# EAGLE design LCR (EAGLE 9.4.2)

## Sheet 1 of 3
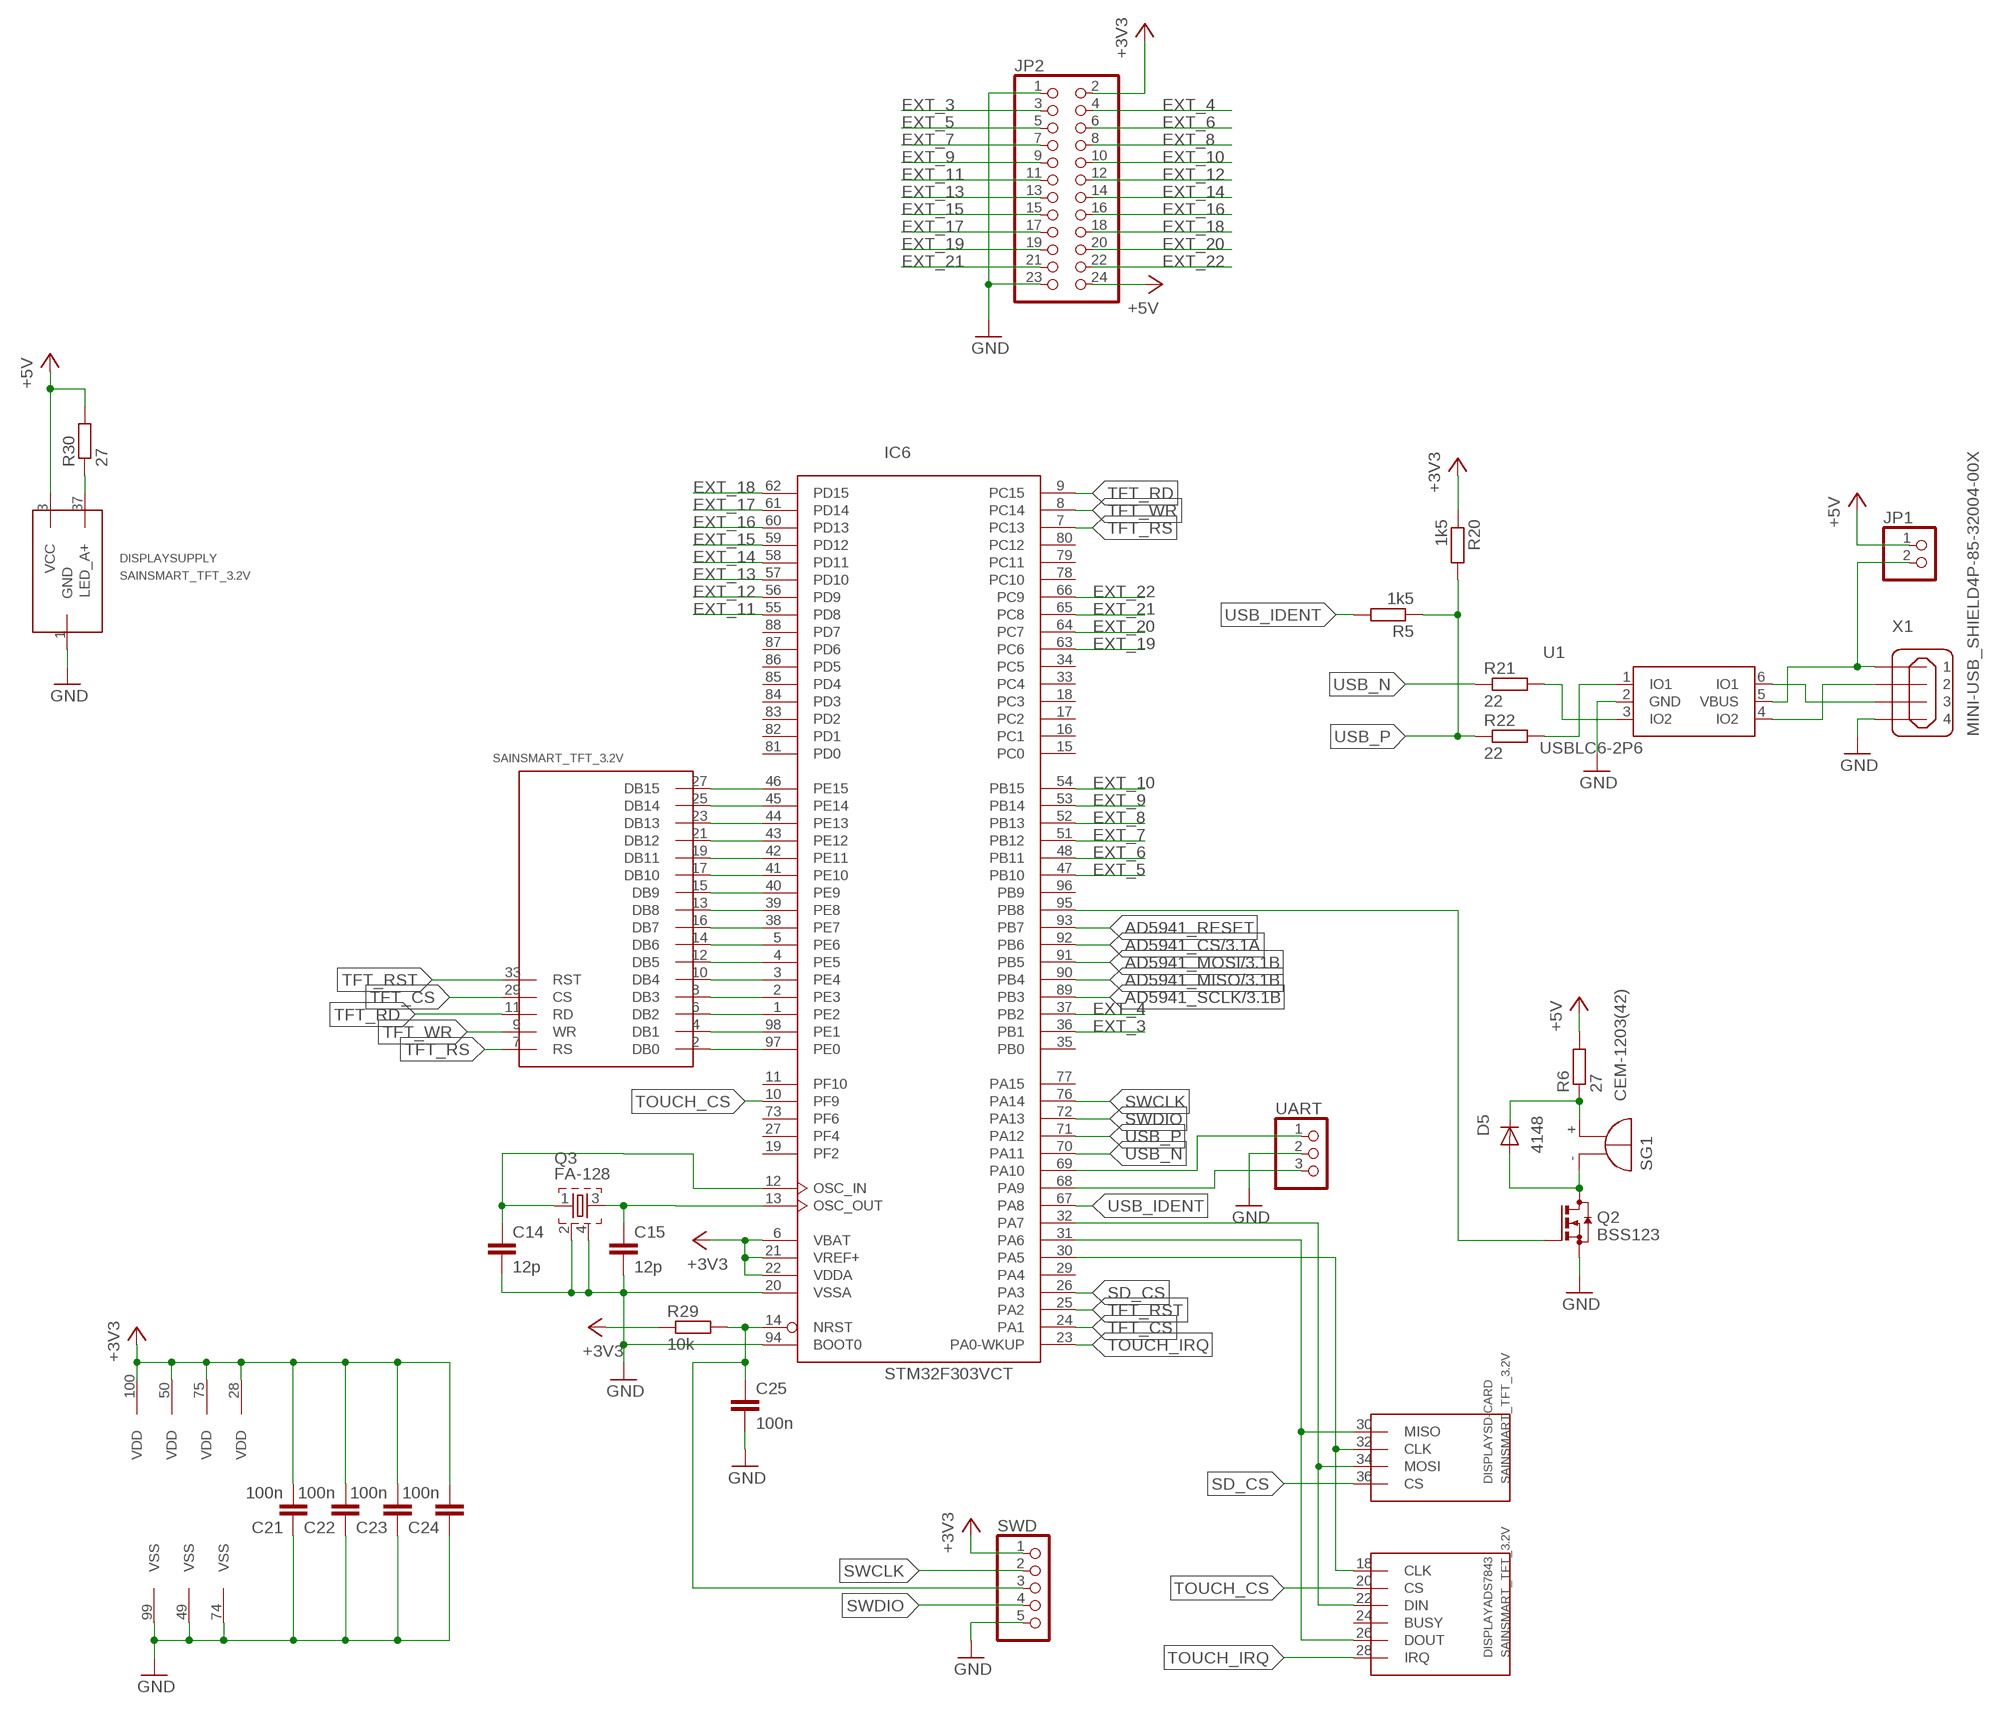
[diagram p0: schematic, sheet 1]

### Parts
C14  12p  C-EUC0603K  [C0603K]
C15  12p  C-EUC0603K  [C0603K]
C21  100n  C-EUC0603K  [C0603K]
C22  100n  C-EUC0603K  [C0603K]
C23  100n  C-EUC0603K  [C0603K]
C24  100n  C-EUC0603K  [C0603K]
C25  100n  C-EUC0603K  [C0603K]
D5  4148  DIODE-SOD123  [SOD123]
DISPLAY  SAINSMART_TFT_3.2V  [SAINSMART_ANGLED]
IC6  STM32F303VCT  [LQFP100]
JP1  PINHD-1X2  [1X02]
JP2  PINHD-2X12  [2X12]
Q2  BSS123  [SOT23]
Q3  FA-128  [FA-128]
R5  1k5  R-EU_R0603  [R0603]
R6  27  R-EU_R1206  [R1206]
R20  1k5  R-EU_R0603  [R0603]
R21  22  R-EU_R0603  [R0603]
R22  22  R-EU_R0603  [R0603]
R29  10k  R-EU_R0603  [R0603]
R30  27  R-EU_R1206  [R1206]
SG1  CEM-1203(42)  F/QMBIII  [F/QMBIII]
SWD  PINHD-1X5  [1X05]
U1  USBLC6-2P6  [SOT23-6]
UART  PINHD-1X3  [1X03]
X1  MINI-USB_SHIELD4P-85-32004-00X  [85-32004-00X]

### Nets
+3V3: C21.2 C22.2 C23.2 C24.2 IC6.6(VBAT) IC6.21(VREF+) IC6.22(VDDA) IC6.28(VDD) IC6.50(VDD) IC6.75(VDD) IC6.100(VDD) JP2.2 R20.1 R29.1 SWD.1 ; also sheet 2,3
+5V: DISPLAY.3(SUPPLY:VCC) JP1.1 JP2.24 R6.2 R30.2 ; also sheet 2
AD5941_CS: IC6.92(PB6) ; also sheet 3
AD5941_MISO: IC6.90(PB4) ; also sheet 3
AD5941_MOSI: IC6.91(PB5) ; also sheet 3
AD5941_RESET: IC6.93(PB7)
AD5941_SCLK: IC6.89(PB3) ; also sheet 3
EXT_3: IC6.36(PB1) JP2.3
EXT_4: IC6.37(PB2) JP2.4
EXT_5: IC6.47(PB10) JP2.5
EXT_6: IC6.48(PB11) JP2.6
EXT_7: IC6.51(PB12) JP2.7
EXT_8: IC6.52(PB13) JP2.8
EXT_9: IC6.53(PB14) JP2.9
EXT_10: IC6.54(PB15) JP2.10
EXT_11: IC6.55(PD8) JP2.11
EXT_12: IC6.56(PD9) JP2.12
EXT_13: IC6.57(PD10) JP2.13
EXT_14: IC6.58(PD11) JP2.14
EXT_15: IC6.59(PD12) JP2.15
EXT_16: IC6.60(PD13) JP2.16
EXT_17: IC6.61(PD14) JP2.17
EXT_18: IC6.62(PD15) JP2.18
EXT_19: IC6.63(PC6) JP2.19
EXT_20: IC6.64(PC7) JP2.20
EXT_21: IC6.65(PC8) JP2.21
EXT_22: IC6.66(PC9) JP2.22
GND: C14.2 C15.2 C21.1 C22.1 C23.1 C24.1 C25.2 DISPLAY.1(SUPPLY:GND) IC6.20(VSSA) IC6.49(VSS) IC6.74(VSS) IC6.94(BOOT0) IC6.99(VSS) JP2.1 JP2.23 Q2.2(S) Q3.2 Q3.4 SWD.5 U1.2(GND) UART.2 X1.4 ; also sheet 2,3
N$22: R21.2 U1.3(IO2)
N$38: IC6.95(PB8) Q2.1(G)
N$40: R22.2 U1.1(IO1)
N$41: DISPLAY.2(SSD1289:DB0) IC6.97(PE0)
N$43: DISPLAY.4(SSD1289:DB1) IC6.98(PE1)
N$44: DISPLAY.6(SSD1289:DB2) IC6.1(PE2)
N$45: DISPLAY.8(SSD1289:DB3) IC6.2(PE3)
N$46: DISPLAY.22(ADS7843:DIN) DISPLAY.34(SD-CARD:MOSI) IC6.32(PA7)
N$47: DISPLAY.10(SSD1289:DB4) IC6.3(PE4)
N$48: DISPLAY.12(SSD1289:DB5) IC6.4(PE5)
N$49: DISPLAY.14(SSD1289:DB6) IC6.5(PE6)
N$50: DISPLAY.16(SSD1289:DB7) IC6.38(PE7)
N$51: DISPLAY.26(ADS7843:DOUT) DISPLAY.30(SD-CARD:MISO) IC6.31(PA6)
N$52: DISPLAY.18(ADS7843:CLK) DISPLAY.32(SD-CARD:CLK) IC6.30(PA5)
N$53: C14.1 IC6.12(OSC_IN) Q3.1
N$54: C15.1 IC6.13(OSC_OUT) Q3.3
N$55: U1.6(IO1) X1.3
N$56: U1.4(IO2) X1.2
N$61: DISPLAY.37(SUPPLY:LED_A+) R30.1
N$62: DISPLAY.13(SSD1289:DB8) IC6.39(PE8)
N$63: DISPLAY.15(SSD1289:DB9) IC6.40(PE9)
N$64: DISPLAY.17(SSD1289:DB10) IC6.41(PE10)
N$65: DISPLAY.19(SSD1289:DB11) IC6.42(PE11)
N$66: JP1.2 U1.5(VBUS) X1.1
N$67: D5.C R6.1 SG1.+(-)
N$68: DISPLAY.21(SSD1289:DB12) IC6.43(PE12)
N$69: DISPLAY.23(SSD1289:DB13) IC6.44(PE13)
N$70: DISPLAY.25(SSD1289:DB14) IC6.45(PE14)
N$71: DISPLAY.27(SSD1289:DB15) IC6.46(PE15)
N$72: D5.A Q2.3(D) SG1.-(+)
NRST: C25.1 IC6.14(NRST) R29.2 SWD.3
RX: IC6.69(PA10) UART.1
SD_CS: DISPLAY.36(SD-CARD:CS) IC6.26(PA3)
SWCLK: IC6.76(PA14) SWD.2
SWDIO: IC6.72(PA13) SWD.4
TFT_CS: DISPLAY.29(SSD1289:CS) IC6.24(PA1)
TFT_RD: DISPLAY.11(SSD1289:RD) IC6.9(PC15)
TFT_RS: DISPLAY.7(SSD1289:RS) IC6.7(PC13)
TFT_RST: DISPLAY.33(SSD1289:RST) IC6.25(PA2)
TFT_WR: DISPLAY.9(SSD1289:WR) IC6.8(PC14)
TOUCH_CS: DISPLAY.20(ADS7843:CS) IC6.10(PF9)
TOUCH_IRQ: DISPLAY.28(ADS7843:IRQ) IC6.23(PA0-WKUP)
TX: IC6.68(PA9) UART.3
USB_IDENT: IC6.67(PA8) R5.2
USB_N: IC6.70(PA11) R21.1
USB_P: IC6.71(PA12) R5.1 R20.2 R22.1
Unconnected: DISPLAY.24(ADS7843:BUSY) IC6.11(PF10) IC6.15(PC0) IC6.16(PC1) IC6.17(PC2) IC6.18(PC3) IC6.19(PF2) IC6.27(PF4) IC6.29(PA4) IC6.33(PC4) IC6.34(PC5) IC6.35(PB0) IC6.73(PF6) IC6.77(PA15) IC6.78(PC10) IC6.79(PC11) IC6.80(PC12) IC6.81(PD0) IC6.82(PD1) IC6.83(PD2) IC6.84(PD3) IC6.85(PD4) IC6.86(PD5) IC6.87(PD6) IC6.88(PD7) IC6.96(PB9) X1.M1(S1) X1.M2(S2)

## Sheet 2 of 3
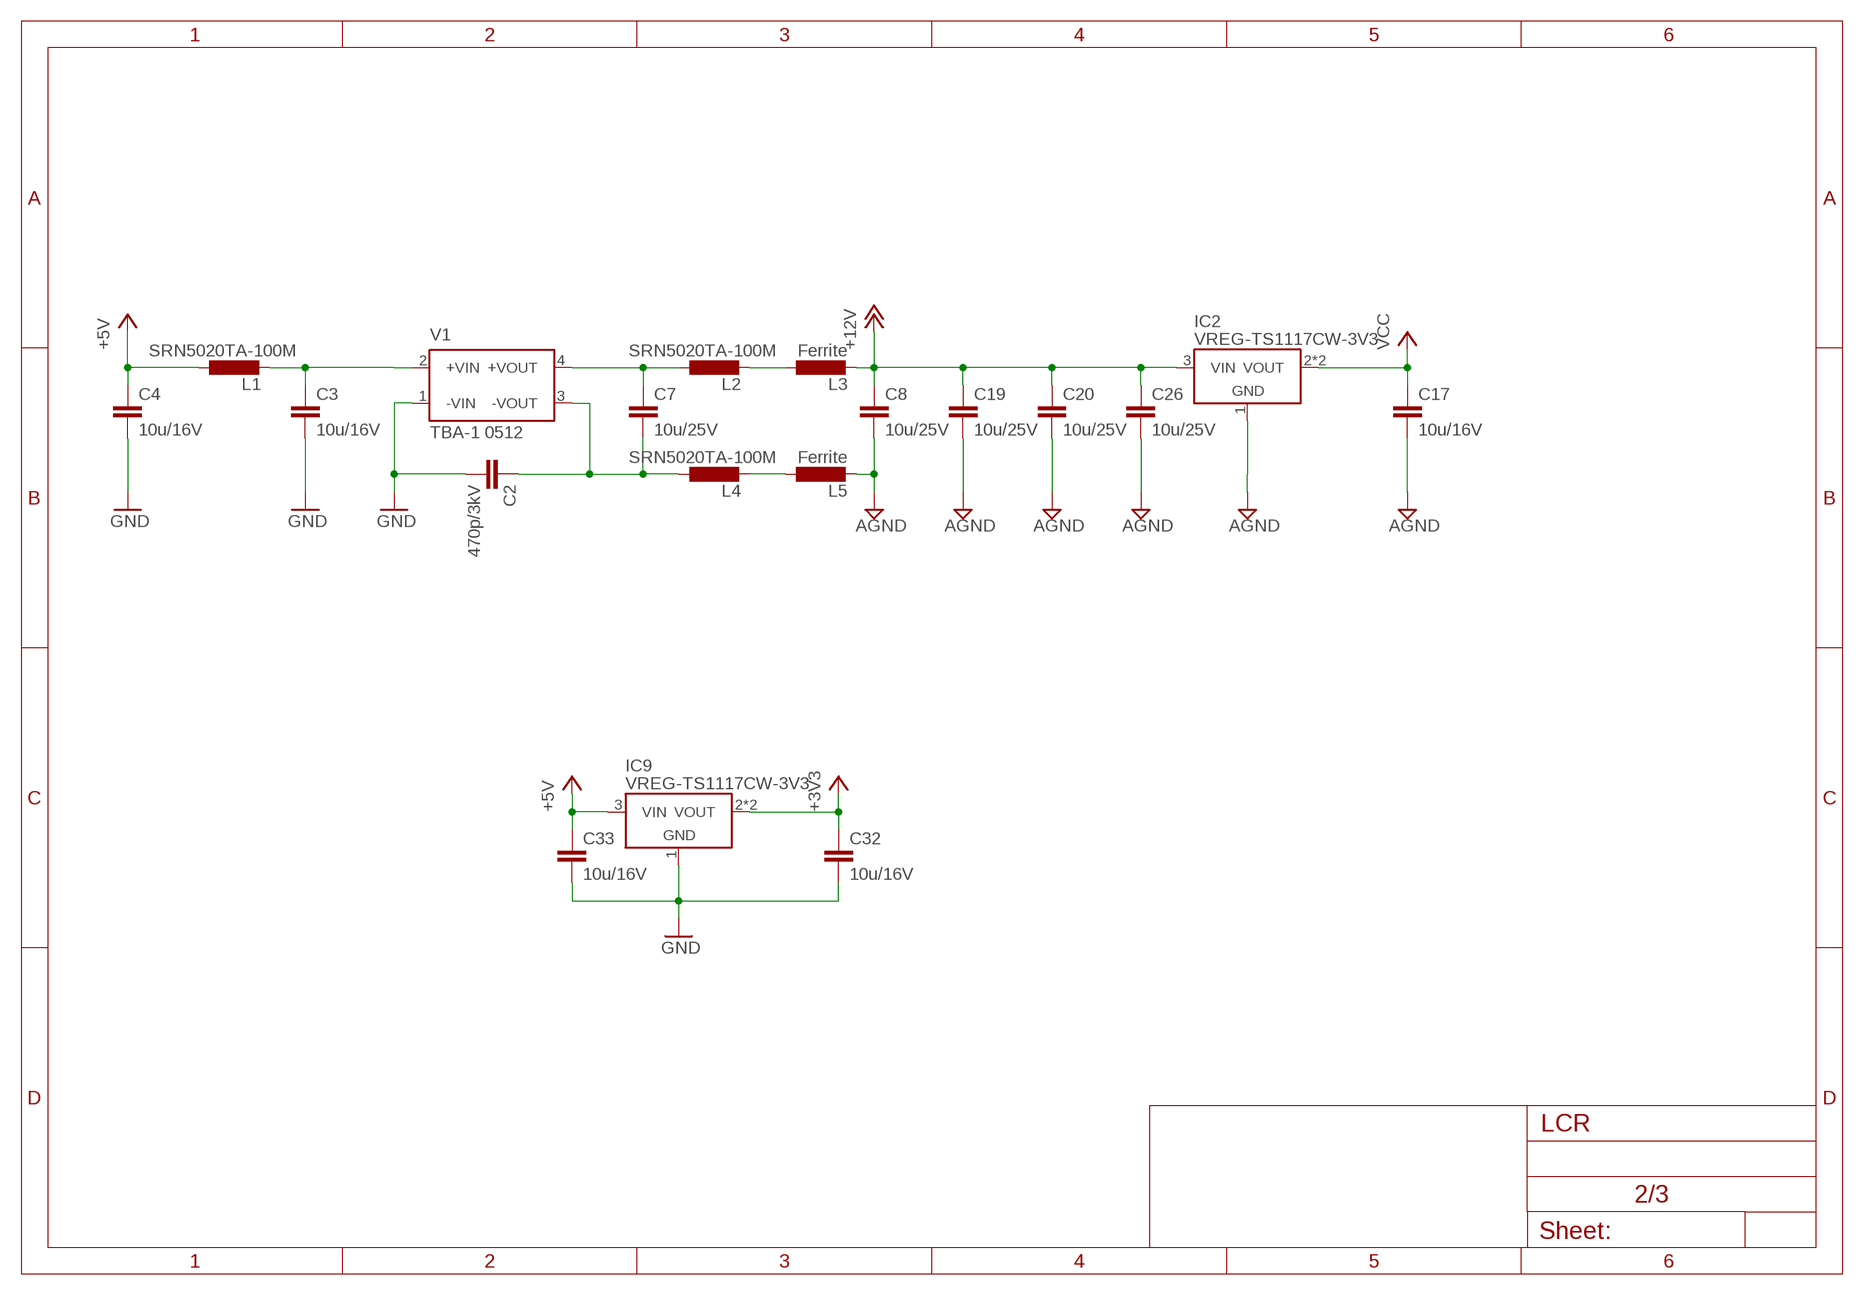
[diagram p1: schematic, sheet 2]

### Parts
C2  470p/3kV  C-EUC1812  [C1812]
C3  10u/16V  C-EUC1206K  [C1206K]
C4  10u/16V  C-EUC1206K  [C1206K]
C7  10u/25V  C-EUC1206K  [C1206K]
C8  10u/25V  C-EUC1206K  [C1206K]
C17  10u/16V  C-EUC1206K  [C1206K]
C19  10u/25V  C-EUC1206K  [C1206K]
C20  10u/25V  C-EUC1206K  [C1206K]
C26  10u/25V  C-EUC1206K  [C1206K]
C32  10u/16V  C-EUC1206K  [C1206K]
C33  10u/16V  C-EUC1206K  [C1206K]
IC2  VREG-TS1117CW-3V3  [SOT223]
IC9  VREG-TS1117CW-3V3  [SOT223]
L1  SRN5020TA-100M  SRN5040  [SRN5040]
L2  SRN5020TA-100M  SRN5040  [SRN5040]
L3  Ferrite  INDUCTOR0603  [R0603]
L4  SRN5020TA-100M  SRN5040  [SRN5040]
L5  Ferrite  INDUCTOR0603  [R0603]
V1  TBA-1 0512  TME0505S  [TME]

### Nets
+3V3: C32.1 IC9.2(VOUT) IC9.4(VOUT) ; also sheet 1,3
+5V: C4.1 C33.1 IC9.3(VIN) L1.P$1 ; also sheet 1
+12V: C8.1 C19.1 C20.1 C26.1 IC2.3(VIN) L3.2 ; also sheet 3
AGND: C8.2 C17.2 C19.2 C20.2 C26.2 IC2.1(GND) L5.2 ; also sheet 3
GND: C2.2 C3.2 C4.2 C32.2 C33.2 IC9.1(GND) V1.1(-VIN) ; also sheet 1,3
N$20: C3.1 L1.P$2 V1.2(+VIN)
N$25: C7.1 L2.P$1 V1.4(+VOUT)
N$26: C2.1 C7.2 L4.P$1 V1.3(-VOUT)
N$36: L2.P$2 L3.1
N$58: L4.P$2 L5.1
VCC: C17.1 IC2.2(VOUT) IC2.4(VOUT) ; also sheet 3

## Sheet 3 of 3
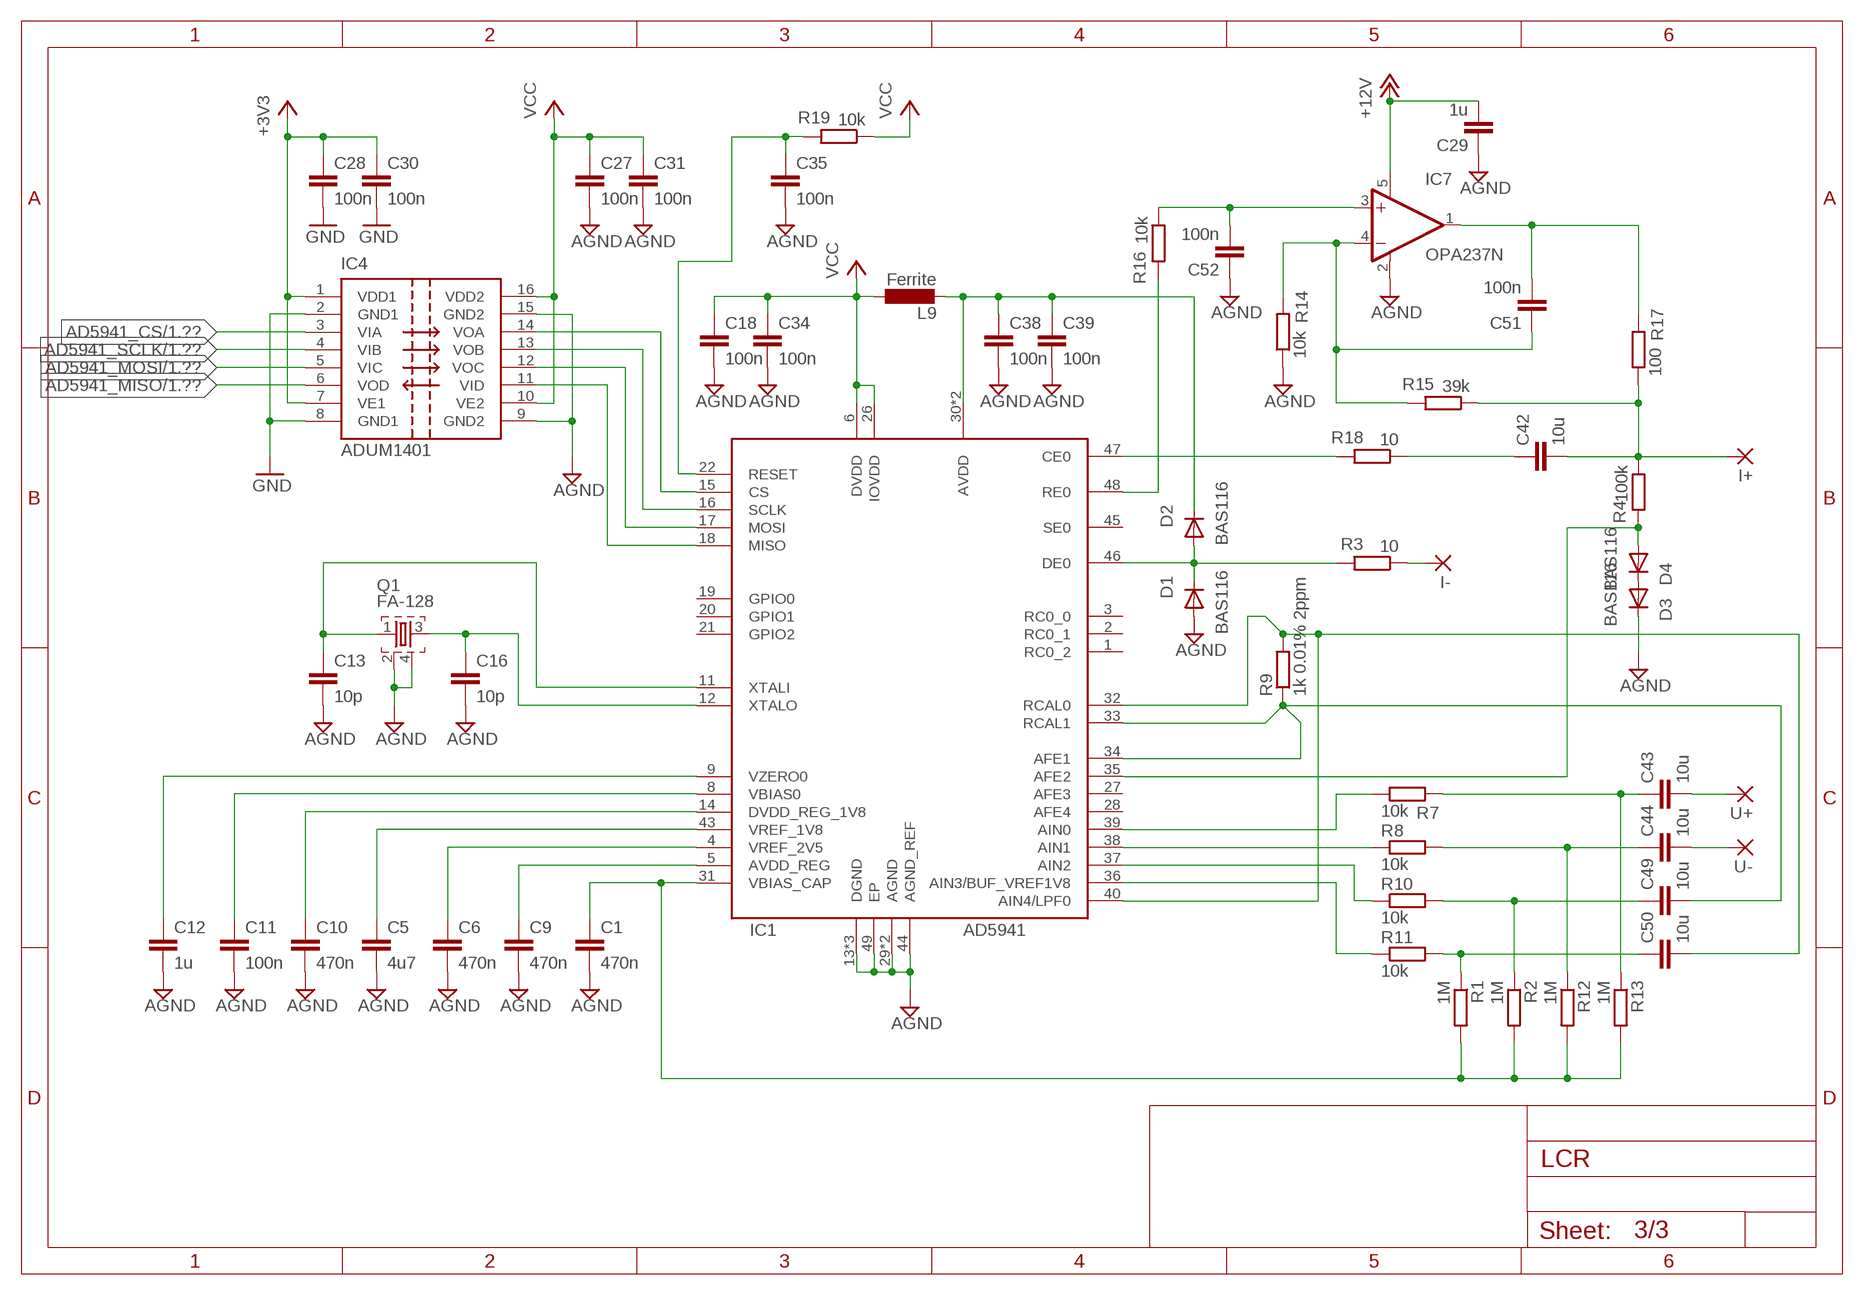
[diagram p2: schematic, sheet 3]

### Parts
C1  470n  C-EUC0603K  [C0603K]
C5  4u7  C-EUC0603K  [C0603K]
C6  470n  C-EUC0603K  [C0603K]
C9  470n  C-EUC0603K  [C0603K]
C10  470n  C-EUC0603K  [C0603K]
C11  100n  C-EUC0603K  [C0603K]
C12  1u  C-EUC0603K  [C0603K]
C13  10p  C-EUC0603K  [C0603K]
C16  10p  C-EUC0603K  [C0603K]
C18  100n  C-EUC0603K  [C0603K]
C27  100n  C-EUC0603K  [C0603K]
C28  100n  C-EUC0603K  [C0603K]
C29  1u  C-EUC0603K  [C0603K]
C30  100n  C-EUC0603K  [C0603K]
C31  100n  C-EUC0603K  [C0603K]
C34  100n  C-EUC0603K  [C0603K]
C35  100n  C-EUC0603K  [C0603K]
C38  100n  C-EUC0603K  [C0603K]
C39  100n  C-EUC0603K  [C0603K]
C42  10u  C-EUC1206K  [C1206K]
C43  10u  C-EUC1206K  [C1206K]
C44  10u  C-EUC1206K  [C1206K]
C49  10u  C-EUC1206K  [C1206K]
C50  10u  C-EUC1206K  [C1206K]
C51  100n  C-EUC0603K  [C0603K]
C52  100n  C-EUC0603K  [C0603K]
D1  BAS116  DIODE-SOD123  [SOD123]
D2  BAS116  DIODE-SOD123  [SOD123]
D3  BAS116  DIODE-SOD123  [SOD123]
D4  BAS116  DIODE-SOD123  [SOD123]
I+  2,54/1,1  [2,54/1,1]
I-  2,54/1,1  [2,54/1,1]
IC1  AD5941  [QFN50P700X700X80-49T510N]
IC4  ADUM1401  [SO16W]
IC7  OPA237N  [SOT23-5]
L9  Ferrite  INDUCTOR0603  [R0603]
Q1  FA-128  [FA-128]
R1  1M  R-EU_R0603  [R0603]
R2  1M  R-EU_R0603  [R0603]
R3  10  R-EU_R0603  [R0603]
R4  100k  R-EU_R0603  [R0603]
R7  10k  R-EU_R0603  [R0603]
R8  10k  R-EU_R0603  [R0603]
R9  1k 0.01% 2ppm  R-EU_M0805  [M0805]
R10  10k  R-EU_R0603  [R0603]
R11  10k  R-EU_R0603  [R0603]
R12  1M  R-EU_R0603  [R0603]
R13  1M  R-EU_R0603  [R0603]
R14  10k  R-EU_R0603  [R0603]
R15  39k  R-EU_R0603  [R0603]
R16  10k  R-EU_R0603  [R0603]
R17  100  R-EU_R0603  [R0603]
R18  10  R-EU_R0603  [R0603]
R19  10k  R-EU_R0603  [R0603]
U+  2,54/1,1  [2,54/1,1]
U-  2,54/1,1  [2,54/1,1]

### Nets
+3V3: C28.1 C30.1 IC4.1(VDD1) IC4.7(VE1) ; also sheet 1,2
+12V: C29.2 IC7.5(V+) ; also sheet 2
AD5941_CS: IC4.3(VIA) ; also sheet 1
AD5941_MISO: IC4.6(VOD) ; also sheet 1
AD5941_MOSI: IC4.5(VIC) ; also sheet 1
AD5941_SCLK: IC4.4(VIB) ; also sheet 1
AGND: C1.2 C5.2 C6.2 C9.2 C10.2 C11.2 C12.2 C13.2 C16.2 C18.2 C27.2 C29.1 C31.2 C34.2 C35.2 C38.2 C39.2 C52.1 D1.A D3.C IC1.13(DGND) IC1.23(DGND) IC1.25(DGND) IC1.29(AGND) IC1.42(AGND) IC1.44(AGND_REF) IC1.49(EP) IC4.9(GND2) IC4.15(GND2) IC7.2(V-) Q1.2 Q1.4 R14.1 ; also sheet 2
GND: C28.2 C30.2 IC4.2(GND1) IC4.8(GND1) ; also sheet 1,2
I+: C42.2 I+.1(P) R4.1 R15.1 R17.1
I-: I-.1(P) R3.1
N$1: C1.1 IC1.31(VBIAS_CAP) R1.2 R2.2 R12.2 R13.2
N$2: C6.1 IC1.4(VREF_2V5)
N$3: C5.1 IC1.43(VREF_1V8)
N$4: C9.1 IC1.5(AVDD_REG)
N$5: C10.1 IC1.14(DVDD_REG_1V8)
N$6: C11.1 IC1.8(VBIAS0)
N$7: C12.1 IC1.9(VZERO0)
N$8: C16.1 IC1.12(XTALO) Q1.3
N$9: C13.1 IC1.11(XTALI) Q1.1
N$10: IC1.17(MOSI) IC4.12(VOC)
N$11: C42.1 R18.1
N$12: C35.1 IC1.22(RESET) R19.2
N$13: IC1.15(CS) IC4.14(VOA)
N$14: IC1.16(SCLK) IC4.13(VOB)
N$15: IC1.18(MISO) IC4.11(VID)
N$16: C38.1 C39.1 D2.C IC1.30(AVDD) IC1.41(AVDD) L9.2
N$17: IC1.47(CE0) R18.2
N$18: IC1.39(AIN0) R7.1
N$19: IC1.38(AIN1) R8.1
N$21: C44.1 R8.2 R12.1
N$23: C43.1 R7.2 R13.1
N$24: C49.2 IC1.33(RCAL1) IC1.34(AFE1) R9.1
N$27: IC1.37(AIN2) R10.1
N$28: IC1.36(AIN3/BUF_VREF1V8) R11.1
N$29: C50.1 R1.1 R11.2
N$30: C49.1 R2.1 R10.2
N$31: IC1.48(RE0) R16.2
N$32: C52.2 IC7.3(+IN) R16.1
N$33: C51.1 IC7.4(-IN) R14.2 R15.2
N$34: C51.2 IC7.1(OUT) R17.2
N$35: D1.C D2.A IC1.46(DE0) R3.2
N$37: D4.A IC1.35(AFE2) R4.2
N$39: D3.A D4.C
N$59: C50.2 IC1.32(RCAL0) IC1.40(AIN4/LPF0) R9.2
U+: C43.2 U+.1(P)
U-: C44.2 U-.1(P)
VCC: C18.1 C27.1 C31.1 C34.1 IC1.6(DVDD) IC1.26(IOVDD) IC4.10(VE2) IC4.16(VDD2) L9.1 R19.1 ; also sheet 2
Unconnected: IC1.1(RC0_2) IC1.2(RC0_1) IC1.3(RC0_0) IC1.19(GPIO0) IC1.20(GPIO1) IC1.21(GPIO2) IC1.27(AFE3) IC1.28(AFE4) IC1.45(SE0)

## Library data of the parts
C1 C3-C35 C38 C39 C51 C52 = rcl:C-EU: CAPACITOR, European symbol
C2 C42-C44 C49 C50 = resistor:C-EU: CAPACITOR, European symbol
D1-D5 = diode:DIODE-: DIODE
DISPLAY = sainsmart:SAINSMART_TFT_3.2
I+ I- U+ U- = wirepad:2,54/1,1: THROUGH-HOLE PAD
IC1 = custom-ic:AD5941
IC2 IC9 = we-power-mod:VREG: Voltage Regulators (LDOs, Switching Converters...) LDOs Taiwan Semi TS1117 800mA max 15V - compatible On Semi NCP1117 1A max 20V - compatible Diodes AP2111H 0.6A max 6V (0.25V@0.6A) - compatible Diodes AP2114H 1A max 6V (0.45V@1A) Taiwan Semi TS9011 250mA max 12V - compatible Diodes AP2210 300mA max 15V - compatible Microchip MCP1700 250mA max 6.5V - compatible Microchip MCP1702 250mA max 13V - compatible Microchip MCP1703 250mA max 16V - compatible Microchip MCP1754 150mA max 16V Taiwan Semi TS5204 150mA max 16V (low noise) DC/DC Converter Modules Recom R-78Ex.x-1.0-W36 1A max 28V - compatible CUI V78xx-2000 2A max 18V Murata OKI-78SR-x.x/1.5-W36 1.5A max 36V
IC4 = adum140x:ADUM1401
IC6 = micro-stm_v3:STM32F303V*T: ARM 32-bit Cortex™-M3 CPU 72 MHz maximum frequency 128 to 256 Kbytes of Flash memory 32 to 40 kbytes of SRAM 87 GPIOs 2.0 to 3.6 V application supply
IC7 = burr-brown:OPA237: Operational Amplifiers Single-Supply, MicroAmplifier(TM) Series; MF: TEXAS INSTRUMENTS; MPN: OPA237NA/250; OC_FARNELL: 4625298; OC_NEWARK: 35C1874
JP1 = pinhead:PINHD-1X2: PIN HEADER
JP2 = pinhead:PINHD-2X12: PIN HEADER
L1 L2 L4 = custom-ic:SRN5040
L3 L5 L9 = rf:INDUCTOR
Q1 Q3 = crystal:FA-: MHz RANGE CRYSTAL UNIT Source: Epson Toyocom
Q2 = transistor-small-signal:BSS123: N-CHANNEL MOS FET
R1-R4 R7 R8 R10-R19 = rcl:R-EU_: RESISTOR, European symbol
R5 R6 R9 R20-R22 R29 R30 = resistor:R-EU_: RESISTOR, European symbol
SG1 = buzzer:F/QMBIII: BUZZER Source: Buerklin; OC_FARNELL: unknown; OC_NEWARK: unknown
SWD = pinhead:PINHD-1X5: PIN HEADER
U1 = alemv:USBLC6-2P6: Very low capacitance ESD protection of VBUS (USB)
UART = pinhead:PINHD-1X3: PIN HEADER
V1 = traco-electronic:TME?*: DC/DC Converter TME Series 1 Watt Source: www.tracopower.com .. tme.pdf; MPN: TME 0505S; OC_FARNELL: 1007538; OC_NEWARK: 51R5321
X1 = con-cypressindustries:MINI-USB_SHIELD4P-: MINI USB 4 Pol. Source: www.cypressindustries.com; OC_FARNELL: unknown; OC_NEWARK: unknown

## Net classes
0 default: width 0.3 mm

## Board
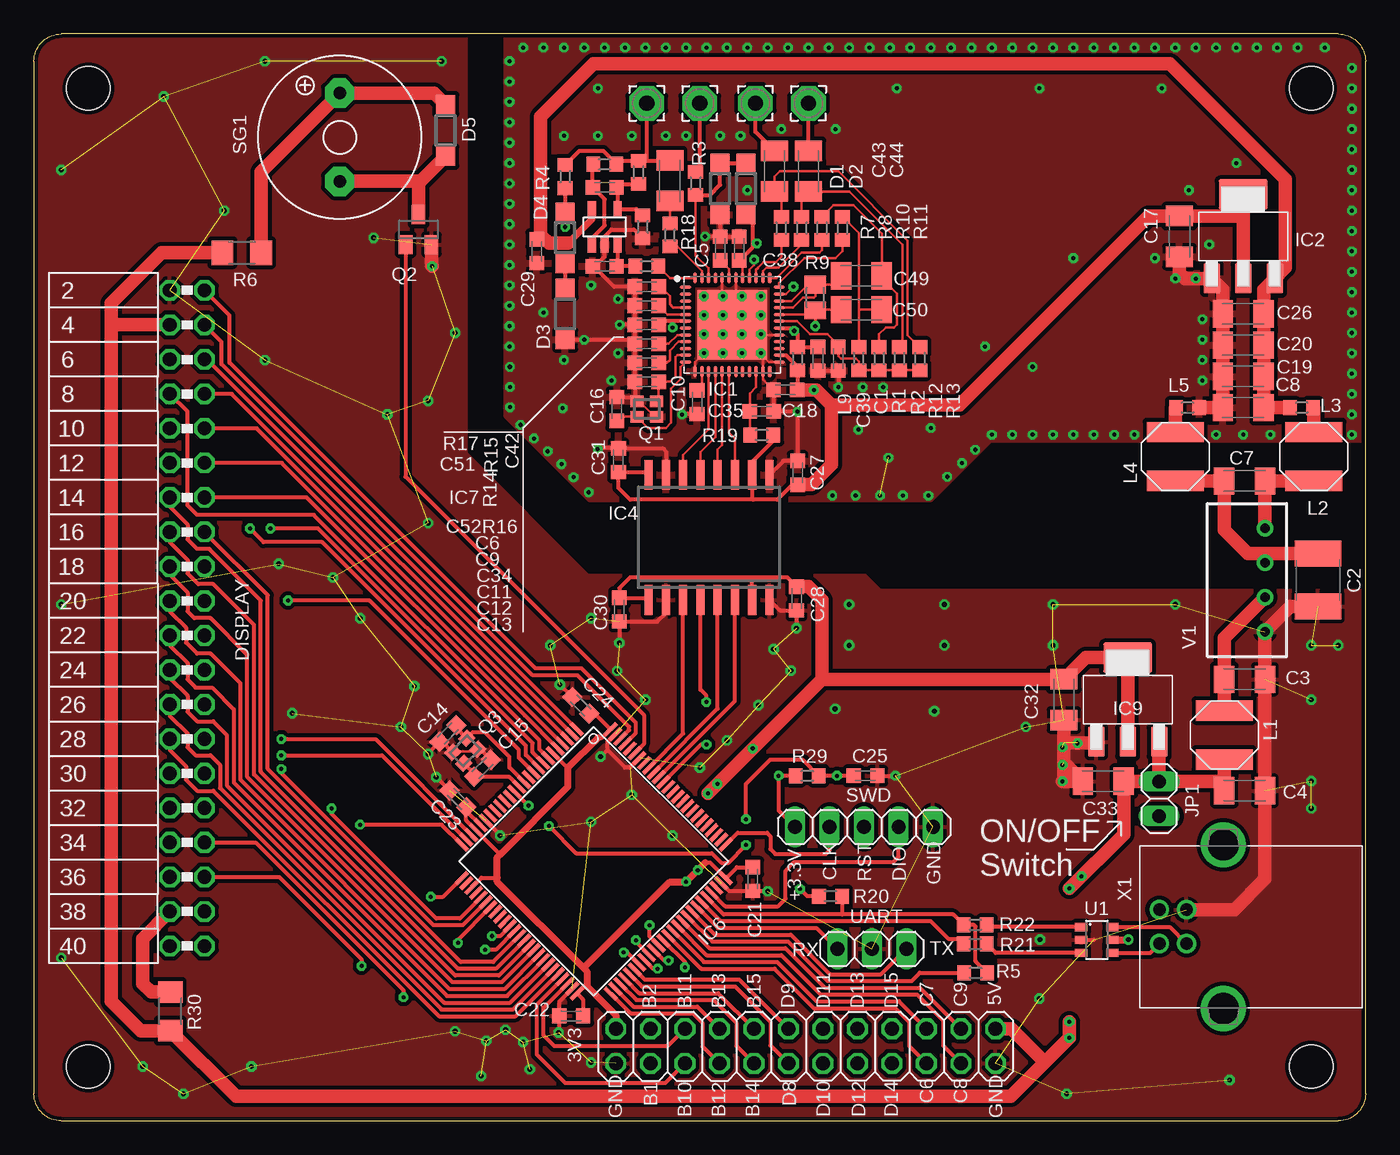
[diagram p3: board, top side]
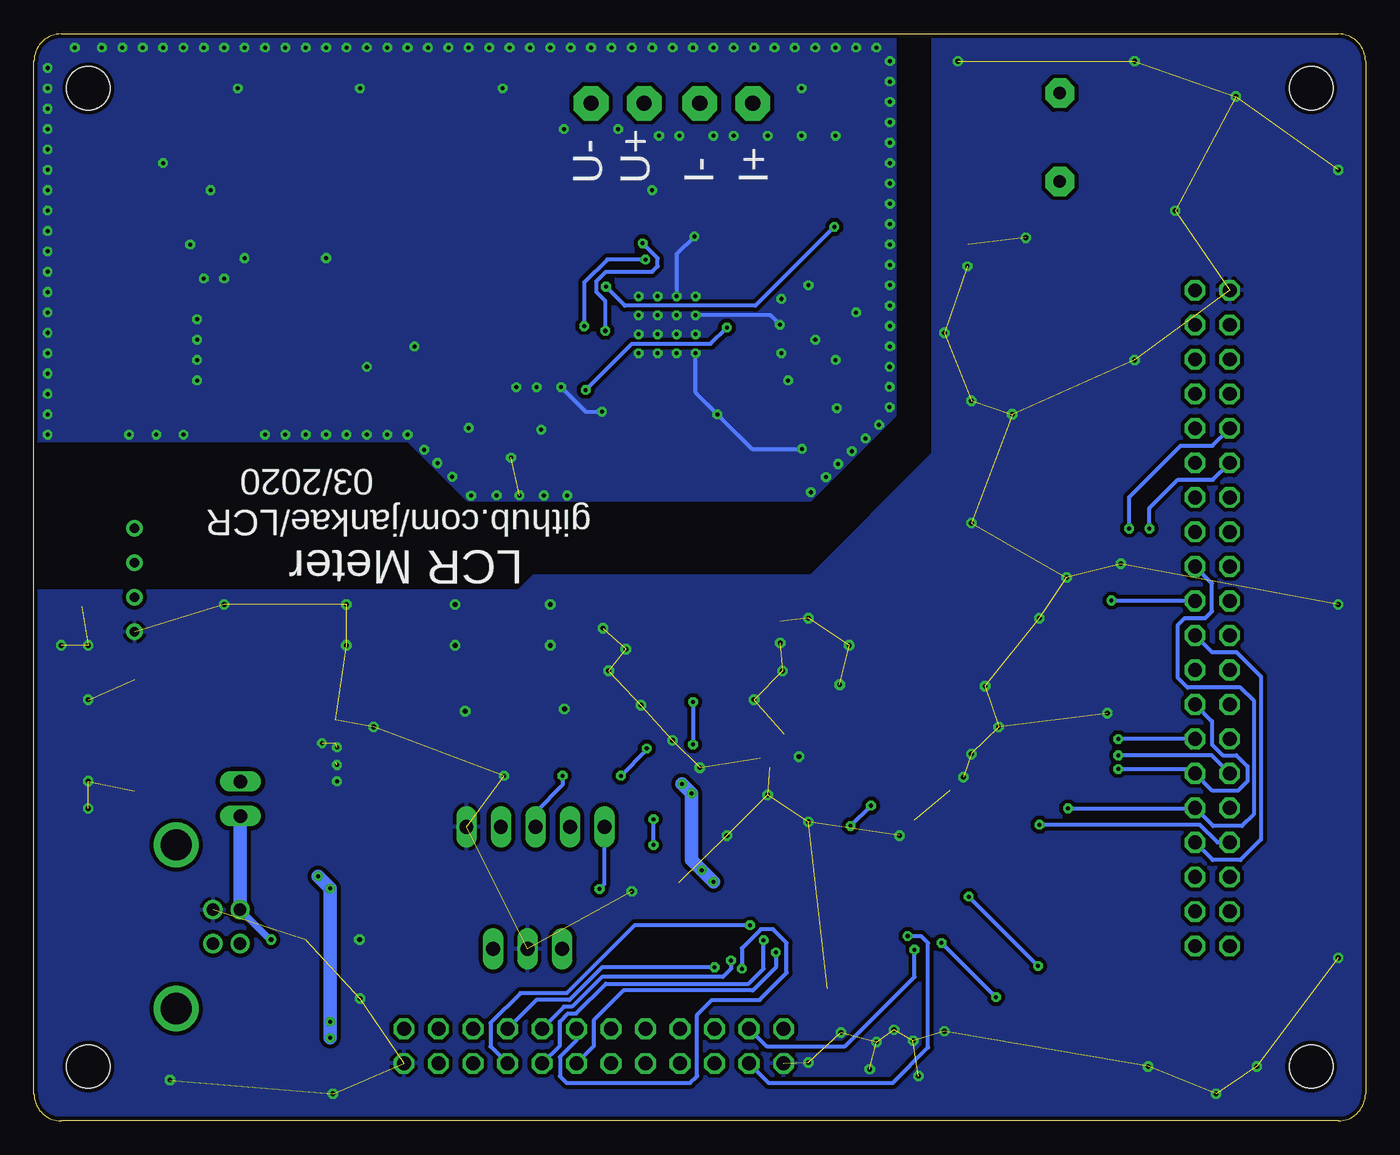
[diagram p4: board, bottom side, seen from below]

Size 98 x 80 mm. Coordinates in mm from the lower left corner, seen from the top.
Outline: 2,0 96,0 arc90 98,2 98,78 arc90 96,80 2,80 arc90 0,78 0,2 arc90 2,0
Copper layers (1*16): Top 0.035mm / dielectric 1.55mm / Bottom 0.035mm
Design rules "JLCPCB4L_7628 *": minimum track width 6mil, minimum drill 0.3mm, track to track 3.5mil, track to pad 3.5mil, pad to pad 3.5mil, via to via 3.5mil, smd to smd 0mil, copper to edge 0.2mm, drill to drill 0.2mm, minimum pad ring 10mil, minimum via ring 8mil, stop-mask expansion 4mil, vias tented up to drill 0mil, thermal gap 10mil
Holes 3.2 mm at 94,4 94,76 4,4 4,76
tKeepout: area 91,73 to 97,79; area 91,1 to 97,7; area 1,1 to 7,7; area 1,73 to 7,79

### Footprints (pad centres in the part's own frame; a part is rotated, then mirrored left to right if it is on the bottom)
C0603K = smd 1.05 x 1.08: 1 -0.875,0; 2 0.875,0
C1812 = smd 1.9 x 3.4: 1 -1.95,0; 2 1.95,0
C1206K = smd 1.5 x 2: 1 -1.5,0; 2 1.5,0
SOD123 = smd 1.4 x 1.4: A 1.9,0; C -1.9,0
SAINSMART_ANGLED = drill 1.016 octagon: 1 -24.13,0; 2 -24.13,2.54; 3 -21.59,0; 4 -21.59,2.54; 5 -19.05,0; 6 -19.05,2.54; 7 -16.51,0; 8 -16.51,2.54; 9 -13.97,0; 10 -13.97,2.54; 11 -11.43,0; 12 -11.43,2.54; 13 -8.89,0; 14 -8.89,2.54; 15 -6.35,0; 16 -6.35,2.54; 17 -3.81,0; 18 -3.81,2.54; 19 -1.27,0; 20 -1.27,2.54; 21 1.27,0; 22 1.27,2.54; 23 3.81,0; 24 3.81,2.54; 25 6.35,0; 26 6.35,2.54; 27 8.89,0; 28 8.89,2.54; 29 11.43,0; 30 11.43,2.54; 31 13.97,0; 32 13.97,2.54; 33 16.51,0; 34 16.51,2.54; 35 19.05,0; 36 19.05,2.54; 37 21.59,0; 38 21.59,2.54; 39 24.13,0; 40 24.13,2.54
2,54/1,1 = drill 1.118 pad 2.54 octagon: 1 0,0
QFN50P700X700X80-49T510N = smd 0.838 x 0.264: 1 -3.446,2.75; 2 -3.446,2.25; 3 -3.446,1.75; 4 -3.446,1.25; 5 -3.446,0.75; 6 -3.446,0.25; 7 -3.446,-0.25; 8 -3.446,-0.75; 9 -3.446,-1.25; 10 -3.446,-1.75; 11 -3.446,-2.25; 12 -3.446,-2.75; 25 3.446,-2.75; 26 3.446,-2.25; 27 3.446,-1.75; 28 3.446,-1.25; 29 3.446,-0.75; 30 3.446,-0.25; 31 3.446,0.25; 32 3.446,0.75; 33 3.446,1.25; 34 3.446,1.75; 35 3.446,2.25; 36 3.446,2.75 | smd 0.264 x 0.838: 13 -2.75,-3.446; 14 -2.25,-3.446; 15 -1.75,-3.446; 16 -1.25,-3.446; 17 -0.75,-3.446; 18 -0.25,-3.446; 19 0.25,-3.446; 20 0.75,-3.446; 21 1.25,-3.446; 22 1.75,-3.446; 23 2.25,-3.446; 24 2.75,-3.446; 37 2.75,3.446; 38 2.25,3.446; 39 1.75,3.446; 40 1.25,3.446; 41 0.75,3.446; 42 0.25,3.446; 43 -0.25,3.446; 44 -0.75,3.446; 45 -1.25,3.446; 46 -1.75,3.446; 47 -2.25,3.446; 48 -2.75,3.446 | smd 5.1 x 5.1: 49 0,0
SOT223 = smd 2.235 x 1.219: 1 -3.099,2.311; 2 -3.099,0; 3 -3.099,-2.311 | smd 2.2 x 3.6: 4 3.099,0
SO16W = smd 0.6 x 2.2: 1 -4.445,-4.6; 2 -3.175,-4.6; 3 -1.905,-4.6; 4 -0.635,-4.6; 5 0.635,-4.6; 6 1.905,-4.6; 7 3.175,-4.6; 8 4.445,-4.6; 9 4.445,4.6; 10 3.175,4.6; 11 1.905,4.6; 12 0.635,4.6; 13 -0.635,4.6; 14 -1.905,4.6; 15 -3.175,4.6; 16 -4.445,4.6
LQFP100 = smd 0.3 x 1.2: 1 -6,-7.75; 2 -5.5,-7.75; 3 -5,-7.75; 4 -4.5,-7.75; 5 -4,-7.75; 6 -3.5,-7.75; 7 -3,-7.75; 8 -2.5,-7.75; 9 -2,-7.75; 10 -1.5,-7.75; 11 -1,-7.75; 12 -0.5,-7.75; 13 0,-7.75; 14 0.5,-7.75; 15 1,-7.75; 16 1.5,-7.75; 17 2,-7.75; 18 2.5,-7.75; 19 3,-7.75; 20 3.5,-7.75; 21 4,-7.75; 22 4.5,-7.75; 23 5,-7.75; 24 5.5,-7.75; 25 6,-7.75; 51 6,7.75; 52 5.5,7.75; 53 5,7.75; 54 4.5,7.75; 55 4,7.75; 56 3.5,7.75; 57 3,7.75; 58 2.5,7.75; 59 2,7.75; 60 1.5,7.75; 61 1,7.75; 62 0.5,7.75; 63 0,7.75; 64 -0.5,7.75; 65 -1,7.75; 66 -1.5,7.75; 67 -2,7.75; 68 -2.5,7.75; 69 -3,7.75; 70 -3.5,7.75; 71 -4,7.75; 72 -4.5,7.75; 73 -5,7.75; 74 -5.5,7.75; 75 -6,7.75 | smd 1.2 x 0.3: 26 7.75,-6; 27 7.75,-5.5; 28 7.75,-5; 29 7.75,-4.5; 30 7.75,-4; 31 7.75,-3.5; 32 7.75,-3; 33 7.75,-2.5; 34 7.75,-2; 35 7.75,-1.5; 36 7.75,-1; 37 7.75,-0.5; 38 7.75,0; 39 7.75,0.5; 40 7.75,1; 41 7.75,1.5; 42 7.75,2; 43 7.75,2.5; 44 7.75,3; 45 7.75,3.5; 46 7.75,4; 47 7.75,4.5; 48 7.75,5; 49 7.75,5.5; 50 7.75,6; 76 -7.75,6; 77 -7.75,5.5; 78 -7.75,5; 79 -7.75,4.5; 80 -7.75,4; 81 -7.75,3.5; 82 -7.75,3; 83 -7.75,2.5; 84 -7.75,2; 85 -7.75,1.5; 86 -7.75,1; 87 -7.75,0.5; 88 -7.75,0; 89 -7.75,-0.5; 90 -7.75,-1; 91 -7.75,-1.5; 92 -7.75,-2; 93 -7.75,-2.5; 94 -7.75,-3; 95 -7.75,-3.5; 96 -7.75,-4; 97 -7.75,-4.5; 98 -7.75,-5; 99 -7.75,-5.5; 100 -7.75,-6
SOT23-5 = smd 0.6 x 1.2: 1 -0.95,-1.306; 2 0,-1.306; 3 0.95,-1.306; 4 0.95,1.306; 5 -0.95,1.306
1X02 = drill 1.016 long: 1 -1.27,0; 2 1.27,0
2X12 = drill 1.016 octagon: 1 -13.97,-1.27; 2 -13.97,1.27; 3 -11.43,-1.27; 4 -11.43,1.27; 5 -8.89,-1.27; 6 -8.89,1.27; 7 -6.35,-1.27; 8 -6.35,1.27; 9 -3.81,-1.27; 10 -3.81,1.27; 11 -1.27,-1.27; 12 -1.27,1.27; 13 1.27,-1.27; 14 1.27,1.27; 15 3.81,-1.27; 16 3.81,1.27; 17 6.35,-1.27; 18 6.35,1.27; 19 8.89,-1.27; 20 8.89,1.27; 21 11.43,-1.27; 22 11.43,1.27; 23 13.97,-1.27; 24 13.97,1.27
SRN5040 = smd 1.5 x 4.2: P$1 -1.8,0; P$2 1.8,0
R0603 = smd 1 x 1.1: 1 -0.85,0; 2 0.85,0
FA-128 = smd 0.95 x 0.85: 1 -0.725,-0.575; 2 0.725,-0.575; 3 0.725,0.575; 4 -0.725,0.575
SOT23 = smd 1 x 1.4: 1 -0.95,-1.1; 2 0.95,-1.1; 3 0,1.1
R1206 = smd 1.6 x 1.803: 1 -1.422,0; 2 1.422,0
M0805 = smd 1.3 x 1.6: 1 -0.95,0; 2 0.95,0
F/QMBIII = drill 0.914 pad 2.159 octagon: + 3.251,0; - -3.251,0
1X05 = drill 1.016 long: 1 -5.08,0; 2 -2.54,0; 3 0,0; 4 2.54,0; 5 5.08,0
SOT23-6 = smd 0.6 x 0.9: 1 -0.95,-1.15; 2 0,-1.15; 3 0.95,-1.15; 4 0.95,1.15; 5 0,1.15; 6 -0.95,1.15
1X03 = drill 1.016 long: 1 -2.54,0; 2 0,0; 3 2.54,0
TME = drill 0.7 pad 1.1: 1 -3.81,0; 2 -1.27,0; 3 1.27,0; 4 3.81,0
85-32004-00X = drill 0.92 pad 1.27: 1 4.71,-1.25; 2 4.71,1.25; 3 2.71,1.25; 4 2.71,-1.25 | drill 2.3 pad 3: M1 0,6.02; M2 0,-6.02

### Placement (x,y rotation side)
C1  59.2,56.1 270 top
C2  94.5,39.8 270 top
C3  89.1,32.5 0 top
C4  89.1,24.3 0 top
C5  50.5,64.2 90 top
C6  45.1,61.4 180 top
C7  89.1,47.1 180 top
C8  89,52.5 180 top
C9  45.1,60 180 top
C10  48.8,52.9 270 top
C11  45.1,57.2 180 top
C12  45.1,55.8 180 top
C13  45.1,54.4 180 top
C14  30.47,28.51 225 top
C15  33.01,25.97 45 top
C16  42.9,52.4 90 top
C17  84.3,65.1 270 top
C18  55.3,53.8 180 top
C19  89,54.8 180 top
C20  89,57.1 180 top
C21  52.9,17.8 90 top
C22  39.53,7.73 0 top
C23  31.2,23.7 315 top
C24  40.24,30.58 315 top
C25  61.2,25.4 0 top
C26  89,59.4 180 top
C27  56.2,47.7 90 top
C28  56.12,38.45 270 top
C29  37,64 90 top
C30  43.09,37.62 270 top
C31  43.02,48.63 90 top
C32  75.8,31 270 top
C33  78.7,25 180 top
C34  45.1,58.6 180 top
C35  53.56,52.23 0 top
C38  51.9,64.2 90 top
C39  57.7,56.1 270 top
C42  46.8,69.2 90 top
C43  54.5,69.9 90 top
C44  57,69.9 90 top
C49  60.9,62.2 180 top
C50  60.9,59.7 180 top
C51  42,68.7 180 top
C52  42,62.9 0 top
D1  50.5,68.6 270 top
D2  52.4,68.6 90 top
D3  39.1,59.4 90 top
D4  39.1,65 90 top
D5  30.3,72.9 270 top
DISPLAY  10,37 270 top
I+  45.1,74.9 90 top
I-  49,74.9 90 top
IC1  51.4,58.6 0 top
IC2  89,65.1 90 top
IC4  49.68,42.95 0 top
IC6  41.2,19.1 225 top
IC7  42,65.8 0 top
IC9  80.5,31 90 top
JP1  82.8,23.7 270 top
JP2  56.8,5.5 0 top
L1  87.6,28.4 90 top
L2  94.2,48.9 90 top
L3  93.3,52.5 180 top
L4  84,48.9 90 top
L5  84.9,52.5 0 top
L9  56.2,56.1 90 top
Q1  45.1,52.4 180 top
Q2  28.3,65.6 0 top
Q3  31.74,27.24 225 top
R1  60.7,56.1 270 top
R2  62.2,56.1 270 top
R3  48.7,69 270 top
R4  39.1,69.5 270 top
R5  69.3,10.9 180 top
R6  15.3,63.9 180 top
R7  55,65.7 90 top
R8  56.5,65.7 90 top
R9  57.5,60.6 270 top
R10  58,65.7 90 top
R11  59.5,65.7 90 top
R12  63.7,56.1 270 top
R13  65.2,56.1 270 top
R14  44.8,65.8 90 top
R15  44.5,69.8 270 top
R16  45.1,62.9 0 top
R17  42,70.4 180 top
R18  46.8,65.2 270 top
R19  53.56,50.48 180 top
R20  58.62,16.54 0 top
R21  69.28,13.02 0 top
R22  69.28,14.42 0 top
R29  56.9,25.4 0 top
R30  10.04,8.06 270 top
SG1  22.5,72.4 90 top
SWD  61.09,21.64 0 top
U1  78.22,13.32 270 top
U+  53.1,74.9 90 top
U-  57,74.9 90 top
UART  61.67,12.66 0 top
V1  90.6,39.8 90 top
X1  87.53,14.29 180 top

### Tracks (layer width: path | path; a pad name or v marks a point on that pad's centre or on a via)
+3V3  (via drill 0.3)
  Top 0.3: IC6.21 31.82,22.82 C23.2 31.82,22.12 IC6.22 34.24,19.7 34.4,19.7 | C24.2 41.3,29.96 IC6.100 41.81,28.2 41.5,28.2 | C22.2 40.41,8.94 IC6.50 40.7,10.12 40.7,11 | C21.2 51.73,18.68 IC6.75 49.78,19 49.4,19 | IC6.6 39.25,26 39.3,26 | IC6.28 32.93,17.9 34.1,17.9 | R29.1 v54.8,25.4 54.8,22.85 SWD.1 | C28.1 55.44,40 52.77,40 | 52.77,40 43.88,40 43.88,40.01 43.09,39.21 C30.1 45.09,38.5 IC4.1 | IC4.7 52.86,39.91 52.77,40 | R20.1 56.91,16.54 v56.38,17.07
  Top 0.5: 49.4,19 v48.85,18.45 47.95,17.55 46.75,17.55 40.45,11.25 | 40.45,11.25 40.7,11 40.7,9.9 42.83,7.77 JP2.2 | 40.45,11.25 34.1,17.6 34.1,17.9 34.1,19.4 34.4,19.7 39.3,24.6 39.3,26 41.5,28.2
  Top 1: IC9.2 IC9.4 77.4,34.1 C32.1 58,32.5 | 58,32.5 v52.9,27.4 v49.6,24.1 | C28.1 57,39.32 58,38.32 58,32.5
  Bottom 0.3: v54.8,25.4 52.9,27.3 v52.9,27.4 | v56.38,17.07 56.02,17.43 SWD.1
  Bottom 1: v48,17.6 v48.85,18.45 49.6,19.2 v49.6,24.1 v50.3,24.8
+5V  (via drill 0.3)
  Top 1: JP1.1 IC9.3 | JP1.1 82.77,25 C33.1 80.2,21.1 v76.2,17.1 | JP1.1 87.57,24.97 | 87.57,24.97 87.6,25 L1.P$1 | C4.1 87.57,24.33 87.57,24.97 | 74.4,4.3 v76.2,6.1 v76.2,7.3 | 74.4,4.3 71.9,1.8 14.88,1.8 R30.2 7.86,6.64 5.7,8.8 5.7,58.6 | 5.7,58.6 DISPLAY.3 | R6.2 9.4,63.9 5.7,60.2 5.7,58.6 | JP2.24 71.93,6.77 74.4,4.3
  Bottom 1: v76.2,6.1 v76.2,17.1 v77.1,18
+12V
  Top 0.152: C29.2 37.3,65.17 37.3,65.2
  Top 0.5: 39.3,64.6 41.05,66.35 IC7.5
  Top 1: L3.2 C8.1 C19.1 C20.1 C26.1 90.5,61.19 IC2.3 92.1,62.79 92.1,69.3 83.6,77.8 41.2,77.8 37.3,73.9 37.3,65.2 37.9,64.6 39.3,64.6
AD5941_CS
  Top 0.3: IC6.92 47.78,28.51 IC4.3
AD5941_MISO
  Top 0.3: IC6.90 49.84,29.16 50,29.31 51.59,30.9 IC4.6
AD5941_MOSI
  Top 0.3: IC6.91 50.32,30.34 IC4.5
AD5941_SCLK  (via drill 0.3)
  Top 0.3: v49.49,30.83 49.49,31.31 49.05,31.75 IC4.4 | v49.5,27.7 49.09,27.7 IC6.89
  Bottom 0.3: v49.49,30.83 49.5,30.82 v49.5,27.7
AGND  (via drill 0.3)  (1 unrouted)
  Top 0.2: IC1.13 48.65,55.85 v49.3,56.5 IC1.49 | 53.65,56.3 IC1.23 53.65,54.58 C18.2 | 53.65,56.3 53.65,56.35 v53.5,56.5 52.2,57.8 | IC1.25 54.1,55.85 53.65,56.3 | IC1.29 53.4,57.85 | IC1.42 51.65,58.85 | IC1.44 50.65,60.7 50.65,59.35 51.55,58.45 | Q1.4 45.67,51.83 44.52,52.98 Q1.2
  Top 0.3: D1.A C5.2 | C5.2 C38.2 | C39.2 C1.2 v59.2,54 | C11.2 C12.2 C13.2 44.23,53.23 44.17,53.17 | C11.2 C34.2 | C34.2 C9.2 C6.2 42.7,61.4 41.2,62.9 | C52.1 41.2,62.9 | 41.2,62.9 41.3,62.9 42,63.6 IC7.2 42,65.1 42.5,65.6 44.15,65.6 R14.1 | C16.2 44.08,53.27 44.17,53.17 | 44.17,53.17 Q1.2 | D3.C 43.92,57.5 C11.2 | IC1.49 v50.7,59.3 v49.3,59.3 | IC1.49 50,58.6 v49.3,57.9 | IC1.49 v50.7,57.9 v50.7,56.5 | 52.2,57.8 52.15,57.85 | 52.15,57.85 53.4,57.85 | v53.5,60.7 51.65,58.85 IC1.49 | 52.15,57.85 51.55,58.45 IC1.49 | IC1.49 51.4,59.95 50.65,60.7 | IC1.49 v49.3,60.7 | 51.4,60 v50.7,60.7 | IC1.49 51.4,60 | 51.4,60 v52.1,60.7 | IC1.49 v52.1,59.3 v53.5,59.3 | IC1.49 51.6,58.4 | IC1.49 v52.1,57.9 v52.1,56.5 | C5.2 49.42,65.08 v49.4,65.1 | C18.2 54.42,52.2 v56.2,52.2 C27.2 55.15,48.58 IC4.9 | C34.2 v43.1,58.6 | C10.2 47.73,52.02 v47.7,52 | v41.49,49.45 41.55,49.51 C31.2 46.28,49.51 46.51,49.28 IC4.15
  Top 1: L5.2 C8.2 C19.2 C20.2 C26.2 87.5,61.19 IC2.1 84.7,62 84.3,62.4 C17.2
  Bottom 0.3: v49.4,65.1 50.7,63.8 v50.7,60.7 | v43.1,58.6 43.8,59.3 v49.3,59.3 | v49.3,56.5 49.3,53.6 v47.7,52 45.16,49.45 v41.49,49.45 | v59.2,54 57.4,52.2 v56.2,52.2
  other vias: 53.5,57.9 81,50.5 79.5,50.5 78,50.5 76.5,50.5 75,50.5 73.5,50.5 72,50.5 70.5,50.5 69.28,49.4 68.3,48.42 67.22,47.41 65.83,46.02 63.95,46.03 62.27,46.04 60.48,46.03 38.82,48.34 36.8,50.23 35.8,51.23 35.03,52.52 35.03,54.02 35.02,55.5 35,57 35,58.5 35,60 35,61.5 35,63 35,64.5 35,66 35,67.5 35,69 35,70.5 35,72 35,73.5 35,75 35,76.5 35,78 36,79 37.5,79 39,79 40.5,79 42,79 43.5,79 45,79 46.5,79 48,79 49.5,79 51,79 52.5,79 54,79 55.5,79 57,79 58.5,79 60,79 61.5,79 63,79 64.5,79 66,79 67.5,79 69,79 70.5,79 72,79 73.5,79 75,79 76.5,79 78,79 79.5,79 81,79 82.5,79 84,79 85.5,79 87,79 88.5,79 90,79 91.5,79 87,50.5 89,50.5 91,50.5 97,50.5 97,52 97,53.5 97,55 97,56.5 97,58 97,59.5 97,61 97,62.5 97,64 97,65.5 97,67 97,68.5 97,70 97,71.5 97,73 97,74.5 97,76 97,77.5 95,79 93,79 86,54.5 86,56 86,57.5 86,59 85.5,62 84,62 86.5,64.5 82.5,63.5 39,56 40.5,57.5 37.5,59.5 42.5,54.5 43,56.5 43,60.5 41,61.5 52.5,68.5 52,72.5 50.5,72.5 48,72.5 46.5,72.5 44,72.5 41.5,72.5 39,72.5 41.5,76 61,54 62.5,54 59,73 55,73 85,68.5 88.5,70.5 83,76 63.5,76 74,76 76.5,63.5 70,57 73.5,55.5 66,51 38.92,52.46 37.81,49.28 39.71,47.38 40.82,46.27 58.76,46.03 60.67,50.87 62.89,48.81
  pour Bottom (isolate 0.3): 98,80 34.8,80 34.8,51.93 40.93,45.8 66,45.8 70.4,50.2 98,50.2
  pour Top (isolate 0.3): 98,80 34.8,80 34.8,51.9 40.9,45.8 66,45.8 70.4,50.2 98,50.2
EXT_3  (via drill 0.3)
  Top 0.3: IC6.36 34.29,13.6 v33.7,13.6
  Bottom 0.3: JP2.3 43.94,2.8 34.8,2.8 32.2,5.4 32.2,13.1 32.7,13.6 v33.7,13.6
EXT_4  (via drill 0.3)
  Top 0.3: IC6.37 33.99,12.6 v33.2,12.6
  Bottom 0.3: JP2.4 44.1,5.5 38.3,5.5 33.2,10.6 v33.2,12.6
EXT_5
  Top 0.3: IC6.47 37,8.54 37,4.9 39.1,2.8 46.48,2.8 JP2.5
EXT_6
  Top 0.3: JP2.6 46.64,5.5 38.3,5.5 37.5,6.3 37.5,8.33 IC6.48
EXT_7
  Top 0.3: IC6.51 43.91,7.9 48.5,7.9 49.2,7.2 49.2,5.48 JP2.7
EXT_8
  Top 0.3: IC6.52 44.12,8.4 48.82,8.4 JP2.8
EXT_9
  Top 0.3: IC6.53 44.33,8.9 50,8.9 51.7,7.2 51.7,5.52 JP2.9
EXT_10
  Top 0.3: IC6.54 44.54,9.4 50.36,9.4 JP2.10
EXT_11
  Top 0.3: IC6.55 44.74,9.9 51.6,9.9 54.2,7.3 54.2,5.56 JP2.11
EXT_12
  Top 0.3: IC6.56 44.95,10.4 51.9,10.4 JP2.12
EXT_13  (via drill 0.3)
  Top 0.3: IC6.57 43.66,12.4 v43.4,12.4
  Bottom 0.3: v43.4,12.4 43.4,11.3 45.1,9.6 54.6,9.6 56.8,7.4 56.8,5.5 JP2.13
EXT_14  (via drill 0.3)
  Top 0.3: IC6.58 45.56,11.2 v45.9,11.2
  Bottom 0.3: JP2.14 58.07,5.93 59.3,4.7 59.3,3.3 58.8,2.8 49.7,2.8 49.2,3.3 49.2,7.8 48.1,8.9 44.6,8.9 42.6,10.9 42.6,13.1 43.6,14.1 44.5,14.1 45.9,12.7 v45.9,11.2
EXT_15  (via drill 0.3)
  Top 0.3: IC6.59 44.3,13.17 v44.3,13.3
  Bottom 0.3: JP2.15 59.3,5.54 59.3,7.3 58.7,7.9 58.1,7.9 55.9,10.1 45.4,10.1 44.3,11.2 v44.3,13.3
EXT_16  (via drill 0.3)
  Top 0.3: IC6.60 46.38,11.8 v46.7,11.8
  Bottom 0.3: v46.7,11.8 46.7,11.2 47.3,10.6 56.2,10.6 58.4,8.4 59,8.4 60.61,6.79 JP2.16
EXT_17  (via drill 0.3)
  Top 0.3: IC6.61 45.3,13.59 v45.3,14.4
  Bottom 0.3: v45.3,14.4 53.8,14.4 58.8,9.4 62.2,9.4 64.4,7.2 64.4,5.48 JP2.17
EXT_18  (via drill 0.3)
  Top 0.3: IC6.62 47.9,11.69 v47.9,11.3
  Bottom 0.3: v47.9,11.3 56.2,11.3 58.6,8.9 61.02,8.9 JP2.18
EXT_19
  Top 0.3: IC6.63 49.1,11.2 54.5,11.2 57.4,8.3 63.4,8.3 64.4,7.3 64.4,5.52 JP2.19
EXT_20
  Top 0.3: IC6.64 49.31,11.7 54.7,11.7 57.6,8.8 63.66,8.8 JP2.20
EXT_21
  Top 0.3: IC6.65 49.51,12.2 55,12.2 57.9,9.3 65,9.3 66.9,7.4 66.9,5.56 JP2.21
EXT_22
  Top 0.3: IC6.66 49.72,12.7 55.3,12.7 58.2,9.8 65.2,9.8 JP2.22
GND  (via drill 0.3, 0.35)  (74 unrouted)
  Top 0.2: Q3.2 30.89,27.2 32.51,27.2 Q3.4
  Top 0.3: Q3.4 32.87,27.35 C15.2 | Q3.2 30.06,27.89 C14.2 29,27.05 v29,27 | IC6.49 38.66,8.78 C22.1 38.66,6.5 v38.6,6.5 | IC6.74 51.15,16.93 C21.1 54,16.93 v54,16.9 | C24.1 38.72,32.1 v38.7,32.1 | IC6.94 43.86,26 43.5,26 42.2,27.3 | IC6.99 42.2,27.88 42.2,27.3 | 42.2,27.3 v41.7,26.8 | IC6.20 34.3,21.05 v34.3,21 | C23.1 v29.6,25.3 | v29.6,25.3 | v56.12,36.26 C28.2 54.91,37.57 IC4.8 | C25.2 v63.4,25.4 | v43.08,35.17 v43.09,35.18 C30.2 45.86,36.75 46.51,37.4 IC4.2 | U1.2 77.99,13.32 78.01,13.34
  Top 1: X1.4 88.34,15.54 90.6,17.8 C4.2 C3.2 V1.1 92.46,37.85 C2.2 | 75.8,26.4 C33.2 v75.7,25 75.8,25.1 75.8,26.4 | 75.8,26.4 75.8,27.8 | 75.8,27.8 C32.2 | IC9.1 78.09,27.8 75.8,27.8 | Q2.2 29.25,62.95 v29.3,62.9
  other vias: 75.7,26.2 75.7,27.5 76.8,27.8 41,4.3 36,5.8 34.7,6.7 36.5,3.8 33.3,5.9 32.9,3.3 31,6.6 75,35 75,38 84,38 94,35 96,35 94,23 94,25 94,31 73,29 88,3 76,2 74,9 11,2 16,4 8,4 47,21 41,22 44,24 49,26 51,28 42.92,33.11 45,31 41,37 38,35 29,53 31,58 26,52 29,44 17,56 25,65 14,67 17,78 30,78 9.55,75.4 2,70 2,38 2,12 24,37 22,40 18,41 19,30 28,32 27,29 54.44,34.72 55.7,33.13 53.32,30.59 74.04,13.34 60,38 60,35 67,38 67,35 58.96,30.32 66.26,30.16
  pour Bottom (isolate 0.3, rank 2): 98.8,-3.5 98.8,39 62.3,39 61.19,40.11 40.79,40.11 31.8,49.1 31.8,81.2 -13.4,81.2 -13.4,-3.5
  pour Top (isolate 0.3, rank 2): 98.8,-3.5 98.8,39 62.3,39 61.19,40.11 40.79,40.11 31.8,49.1 31.8,81.2 -13.4,81.2 -13.4,-3.5
I+
  Top 0.3: C42.2 46.75,70.65 44.9,70.65 | 44.9,70.65 R15.1 43.1,70.65 42.88,70.42 | 42.88,70.42 R17.1 | I+.1 45.1,70.85 44.9,70.65 | R4.1 40.15,71.4 41.9,71.4 42.88,70.42
I-
  Top 0.2: R3.1 49,70.15
  Top 0.3: 49,70.15 I-.1
N$1
  Top 0.2: IC1.31 56.15,58.85 57.1,57.9 58.4,57.9 59.2,57.1 C1.1 59.2,56.3 59.4,56.1 60.5,56.1 60.7,55.9 R1.2 R2.2 R12.2 R13.2
N$2
  Top 0.2: IC1.4 47.05,59.85 46.8,60.1 46.8,60.7 46.1,61.4 C6.1
N$3
  Top 0.2: IC1.43 51.15,62.67 C5.1
N$4
  Top 0.2: IC1.5 46.62,59.35 C9.1
N$5
  Top 0.2: IC1.14 49.15,54.12 C10.1
N$6
  Top 0.2: IC1.8 47.35,57.85 46.7,57.2 C11.1
N$7
  Top 0.2: IC1.9 47.45,57.35 46.8,56.7 46.8,56 46.6,55.8 C12.1
N$8
  Top 0.2: IC1.12 47.6,55.5 47.6,54.6 46.9,53.9 46.9,51.4 46.5,51 45.2,51 Q1.3 43.2,51.83 C16.1
N$9
  Top 0.2: IC1.11 47.35,56.35 47.2,56.2 47.2,54.8 46.8,54.4 C13.1 45.98,53.12 Q1.1
N$10
  Top 0.2: IC1.17 50.65,49.74 50.32,49.41 IC4.12
N$11
  Top 0.2: R18.1 C42.1
N$12
  Top 0.2: IC1.22 53.15,54 52.69,53.54 C35.1 | R19.2 52.71,52.2
  Top 0.3: 52.71,52.2 C35.1
N$13
  Top 0.2: IC1.15 49.65,50.89 47.78,49.02 IC4.14
N$14
  Top 0.2: IC4.13 49.05,49.24 50.15,50.34 IC1.16
N$15
  Top 0.2: IC1.18 51.15,52 51.15,51.75 51.15,50.67 51.59,50.23 IC4.11
N$16  (via drill 0.3)
  Top 0.2: IC1.41 52.15,63.08 C38.1
  Top 0.3: IC1.30 55.75,58.35 v55.95,58.15 56.2,57.9 L9.2 57.67,56.95 C39.1 | C38.1 52.9,64.33 52.9,64.6 | D2.C 52.9,66.2 52.9,64.6 | 52.9,64.6 v53.2,64.6
  Bottom 0.3: v55.95,58.15 55.95,60.35 56.6,61 56.6,61.8 55.9,62.5 52.5,62.5 52.1,62.9 52.1,63.5 v53.2,64.6
N$17
  Top 0.2: IC1.47 49.15,62.55 47.35,64.35 R18.2
N$18
  Top 0.2: IC1.39 53.15,62.64 53.29,62.78 53.29,62.79 53.7,63.2 54.6,63.2 55,63.6 R7.1
N$19
  Top 0.2: IC1.38 53.65,62.55 53.9,62.8 54.8,62.8 56.5,64.5 R8.1
N$20
  Top 1: L1.P$2 C3.1 87.6,35.53 V1.2
N$21
  Top 0.2: R8.2 56.5,67.9 C44.1 60,68.4 63.9,64.5 63.9,57.15 R12.1
N$22
  Top 0.3: U1.3 70.78,12.37 R21.2
N$23
  Top 0.2: R7.2 55,67.9 C43.1 54.5,69.5 54.9,69.9 59.2,69.9 64.3,64.8 64.3,57.85 R13.1
N$24
  Top 0.2: C49.2 58.75,61.55 R9.1 57.5,61.4 | IC1.33 55.85,59.85 56.6,60.6 57.4,60.6 57.5,60.7 57.5,61.4 | IC1.34 55.75,60.35 56.8,61.4 57.5,61.4
N$25
  Top 1: V1.4 C7.1 L2.P$1
N$26
  Top 1: C2.1 90.6,41.75 | 90.6,41.75 89.35,41.75 87.6,43.5 C7.2 L4.P$1 | V1.3 90.6,41.75
N$27
  Top 0.2: IC1.37 54.65,62.05 56.5,63.9 57.8,63.9 58,64.1 R10.1
N$28
  Top 0.2: IC1.36 54.85,61.65 56.7,63.5 59,63.5 59.5,64 R11.1
N$29
  Top 0.2: R1.1 60.7,59.7 | 60.7,59.7 C50.1 | 60.7,59.7 60.7,65.35 R11.2
N$30
  Top 0.2: R2.1 62.2,57.9 62.7,58.4 63.3,58.4 63.5,58.6 63.5,60.9 62.4,62 C49.1 62.4,65.3 60.3,67.4 58.85,67.4 R10.2
N$31
  Top 0.2: IC1.48 46.8,62.05 R16.2
N$32
  Top 0.3: R16.1 C52.2 42.95,62.98 IC7.3
N$33
  Top 0.3: R14.2 44.34,67.11 IC7.4 42.95,68.62 C51.1 43.12,68.95 R15.2
N$34
  Top 0.3: IC7.1 41.05,64.95 42,65.9 42,67.83 C51.2 41.12,70.38 R17.2
N$35
  Top 0.2: IC1.46 49.65,62.75 48.7,63.7 R3.2
  Top 0.3: R3.2 49.75,68.15 50.5,68.9 D1.C D2.A
N$36
  Top 1: L2.P$2 94.2,52.45 L3.1
N$37  (via drill 0.3)
  Top 0.2: IC1.35 55.35,60.85 v55.9,61.4
  Top 0.3: R4.2 D4.A v39.1,65.8
  Bottom 0.3: v39.1,65.8 44.9,60 54.5,60 v55.9,61.4
N$38
  Top 0.3: Q2.1 27.35,47.41 44.88,29.88 44.88,27.73 IC6.95
N$39
  Top 0.3: D4.C D3.A
N$40
  Top 0.3: U1.1 70.28,14.27 R22.2
N$41
  Top 0.3: IC6.97 44.3,28.56 44.3,29.3 40.3,33.3 36.9,33.3 14.4,55.8 14.4,59.27 DISPLAY.2
N$43
  Top 0.3: IC6.98 43.8,28.77 43.8,29 40,32.8 36.7,32.8 13.8,55.7 13.8,57.33 DISPLAY.4
N$44
  Top 0.3: IC6.1 12.73,56.05 DISPLAY.6
N$45
  Top 0.3: IC6.2 14.57,53.51 DISPLAY.8
N$46  (via drill 0.3 pad 0.6)
  Top 0.3: DISPLAY.34 16.31,20.49 27.2,9.6 v27.2,9.1 | v31.2,13.1 31.2,13.34 IC6.32
  Bottom 0.3: DISPLAY.22 11.31,34.5 9.5,34.5 7.7,32.7 7.7,20.7 9.2,19.2 11.25,19.2 DISPLAY.34 | v27.2,9.1 v31.2,13.1
N$47
  Top 0.3: IC6.3 16.4,50.97 DISPLAY.10
N$48
  Top 0.3: IC6.4 18.23,48.43 DISPLAY.12
N$49
  Top 0.3: IC6.5 36.13,29.83 20.07,45.89 DISPLAY.14
N$50
  Top 0.3: DISPLAY.16 17.2,38.69 17.2,25.9 31.4,11.7 33.8,11.7 IC6.38
N$51  (via drill 0.3 pad 0.6)
  Top 0.3: IC6.31 31.55,14.4 29.4,14.4 18.2,25.6 v18.2,25.9
  Bottom 0.3: DISPLAY.26 11.3,29.41 11.3,27.7 10.5,26.9 9.5,26.9 8.7,26.1 8.7,25 9.4,24.3 11.27,24.3 DISPLAY.30 12.87,25.9 v18.2,25.9
N$52  (via drill 0.3 pad 0.6)
  Top 0.3: IC6.30 31.34,14.9 29.6,14.9 21.9,22.6 v21.9,23
  Bottom 0.3: DISPLAY.18 11.3,39.57 11.3,37.5 11.8,37 13.3,37 13.8,36.5 13.8,32.6 13.1,31.9 9.2,31.9 8.2,30.9 8.2,22.6 9.1,21.7 11.21,21.7 DISPLAY.32 12.57,23 v21.9,23
N$53
  Top 0.3: IC6.12 35,26.01 35,26.8 33.2,28.6 32.29,28.6 Q3.1 31.09,28.92 C14.1
N$54
  Top 0.3: IC6.13 35,25.3 32.45,25.3 C15.1 32.4,25.56 Q3.3
N$55
  Top 0.3: U1.6 83.59,14.27 X1.3
N$56
  Top 0.3: U1.4 82.16,12.37 X1.2
N$58
  Top 1: L4.P$2 84,52.45 L5.1
N$59  (via drill 0.3)
  Top 0.2: IC1.32 57.2,59.35 57.38,59.52 | 57.38,59.52 R9.2 v57.5,58.5 | C50.2 57.55,59.7 57.38,59.52 | v53,63.4 53,63 52.65,62.65 IC1.40
  Bottom 0.3: v53,63.4 55.8,63.4 57.5,61.7 v57.5,58.5
N$61
  Top 1: R30.1 8.62,9.48 8,10.1 8,13.41 DISPLAY.37
N$62
  Top 0.3: DISPLAY.13 10,45.2 11.3,43.9 11.3,42.8 12,42.1 12.9,42.1 16.7,38.3 16.7,25.7 31.2,11.2 34.01,11.2 IC6.39
N$63
  Top 0.3: DISPLAY.15 10,42.6 11.3,41.3 11.3,40.3 12.1,39.5 13.2,39.5 16.2,36.5 16.2,25.5 31,10.7 34.21,10.7 IC6.40
N$64
  Top 0.3: DISPLAY.17 10,40.2 11.3,38.9 11.3,37.5 11.8,37 13,37 15.7,34.3 15.7,25.3 30.8,10.2 34.42,10.2 IC6.41
N$65
  Top 0.3: DISPLAY.19 10,37.5 11.2,36.3 11.2,35.2 12,34.4 13,34.4 15.2,32.2 15.2,25.1 30.6,9.7 34.63,9.7 IC6.42
N$66  (via drill 0.35)
  Top 0.3: 80.53,13.32 v80.55,13.34
  Top 0.5: U1.5 80.53,13.32
  Bottom 0.3: 80.62,13.34 v80.55,13.34
  Bottom 0.5: X1.1 80.62,13.34
  Bottom 1: X1.1 82.83,22.41 JP1.2
N$67
  Top 1: R6.1 16.72,69.87 SG1.+ 29.45,75.65 D5.C
N$68
  Top 0.3: DISPLAY.21 10,35 11.3,33.7 11.3,32.5 11.9,31.9 13.1,31.9 14.7,30.3 14.7,24.9 30.4,9.2 34.84,9.2 IC6.43
N$69
  Top 0.3: DISPLAY.23 10,32.6 11.3,31.3 11.3,30.1 12,29.4 13.2,29.4 14.2,28.4 14.2,24.7 30.2,8.7 35.04,8.7 IC6.44
N$70
  Top 0.3: DISPLAY.25 10,29.8 11.3,28.5 11.3,27.5 11.9,26.9 13,26.9 13.7,26.2 13.7,24.5 30,8.2 35.25,8.2 IC6.45
N$71
  Top 0.3: DISPLAY.27 10,27.3 11.2,26.1 11.2,25.1 12,24.3 13.2,24.3 29.8,7.7 35.46,7.7 IC6.46
N$72
  Top 1: SG1.- 28.45,69.15 | 28.45,69.15 D5.A | Q2.3 28.3,69 28.45,69.15
NRST  (via drill 0.3)
  Top 0.3: C25.1 v59.1,25.4 R29.2 56.55,26.6 54.2,26.6 52.4,24.8 v52.4,22.2 | IC6.14 v36.39,23.2 v36.4,23.2 | v37.9,21.7 39.9,19.7 49.9,19.7 50.6,19 51.1,19 v52.4,20.3
  Bottom 0.3: v59.1,25.4 59.1,24.71 61.09,22.71 SWD.3 | v36.4,23.2 v37.9,21.7 | v52.4,20.3 v52.4,22.2
RX
  Top 0.3: IC6.69 50.34,14.2 57.59,14.2 UART.1
SD_CS  (via drill 0.3 pad 0.6)
  Top 0.3: DISPLAY.36 18.05,17.95 24.1,11.9 v24.1,11.4 | v29.2,16.5 30.12,16.5 IC6.26
  Bottom 0.3: v24.1,11.4 v29.2,16.5
SWCLK
  Top 0.3: IC6.76 51.78,21.2 53.95,21.2 54.2,20.95 54.2,20 54.56,19.64 58.27,19.64 58.55,19.91 SWD.2
SWDIO
  Top 0.3: IC6.72 50.86,15.8 54.76,15.8 55.31,16.35 55.31,18.41 55.94,19.05 63.25,19.05 63.64,19.44 SWD.4
TFT_CS  (via drill 0.3 pad 0.6)
  Top 0.3: v18.2,26.9 25.62,26.9 IC6.24
  Bottom 0.3: DISPLAY.29 11.33,26.9 v18.2,26.9
TFT_RD  (via drill 0.3 pad 0.6)
  Top 0.3: IC6.9 36.2,26.93 36.2,27.6 21.2,42.6 16.9,42.6 v15.9,43.6
  Bottom 0.3: v15.9,43.6 15.9,45.1 13.8,47.2 11.23,47.2 DISPLAY.11
TFT_RS
  Top 0.3: IC6.7 37.2,27.34 37.2,28 20.6,44.6 12,44.6 11.3,45.3 11.3,52.21 DISPLAY.7
TFT_RST  (via drill 0.3 pad 0.6)
  Top 0.3: IC6.25 30.02,21.8 v24,21.8
  Bottom 0.3: DISPLAY.33 10.89,20.49 12.2,21.8 v24,21.8
TFT_WR  (via drill 0.3 pad 0.6)
  Top 0.3: IC6.8 36.7,27.14 36.7,27.8 20.9,43.6 v17.4,43.6
  Bottom 0.3: v17.4,43.6 17.4,45.9 13.6,49.7 11.27,49.7 DISPLAY.9
TOUCH_CS  (via drill 0.3 pad 0.6)
  Top 0.3: IC6.10 35.7,26.72 35.7,27.3 24.7,38.3 v18.7,38.3
  Bottom 0.3: v18.7,38.3 12.57,38.3 DISPLAY.20
TOUCH_IRQ  (via drill 0.3 pad 0.6)
  Top 0.3: v18.2,28.1 25.13,28.1 IC6.23
  Bottom 0.3: DISPLAY.28 v18.19,28.11 v18.2,28.1
TX
  Top 0.3: IC6.68 50.14,13.7 55.7,13.7 58.6,10.8 62.35,10.8 UART.3
U+
  Top 0.3: C43.2 53.1,72.8 U+.1
U-
  Top 0.3: C44.2 U-.1
USB_IDENT
  Top 0.3: R5.2 65.2,10.9 64.6,10.3 58.4,10.3 55.5,13.2 49.93,13.2 IC6.67
USB_N
  Top 0.3: IC6.70 50.55,14.7 66,14.7 67.3,13.4 68.05,13.4 R21.1
USB_P
  Top 0.3: IC6.71 50.76,15.2 59.48,15.2 | 59.48,15.2 67.65,15.2 R22.1 69.18,14.42 69.3,14.3 69.3,11.75 R5.1 | R20.2 59.48,15.2
VCC  (via drill 0.3)
  Top 0.2: 46.09,58.71 C34.1 | 56.2,53.83 C18.1
  Top 0.3: IC1.26 55.35,56.35 56.2,55.5 L9.1 56.2,53.83 | IC1.6 47,58.85 | 47,58.85 46.23,58.85 46.09,58.71 | 47,58.85 v47,58.4 | C18.1 v57.4,53.8 | 56.07,46.83 C27.1 55.83,46.83 54.72,45.72 52.93,45.72 | 52.93,45.72 43.88,45.72 43.02,46.58 C31.1 45.03,47.76 IC4.16 | 52.93,45.72 52.86,45.79 IC4.10 52.86,48.51 54.41,50.06 R19.1
  Top 1: IC2.2 89,66.8 | 89,66.8 IC2.4 | 89,66.8 88.8,66.6 C17.1 82,66.6 68.1,52.7 58.7,52.7 | C18.1 57.6,53.8 58.7,52.7 | C27.1 57.2,46.82 58.7,48.32 58.7,52.7
  Bottom 0.3: v57.4,53.8 54,57.2 48.2,57.2 v47,58.4

### Text on the board
tPlace: ON/OFF / Switch
tNames: CLK | RST | DIO | GND | +3.3V | RX | TX | B2 | B11 | B13 | B15 | D9 | D11 | D13 | D15 | C7 | C9 | 5V | 3V3 | B1 | D8 | C6 | C8 | GND | B10 | B12 | B14 | D10 | D12 | D14 | GND
bNames: I+ | I- | U+ | U- | 03/2020 | github.com/jankae/LCR | LCR Meter